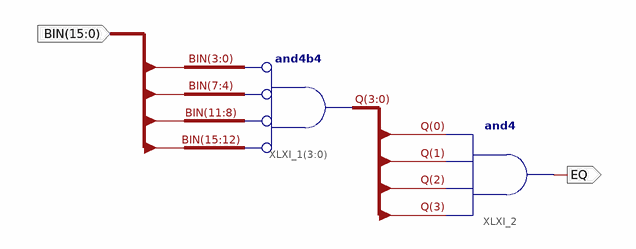
[diagram p0: schematic sheet 1]
// Xilinx ISE schematic Check16BitIs0.sch (spartan6) as structural Verilog: 2 symbols, 2 ports
module Check16BitIs0 (
  input  [15:0] BIN,
  output EQ
);

  wire [3:0] Q;

  assign Q = ~BIN[15:12] & ~BIN[11:8] & ~BIN[7:4] & ~BIN[3:0];  // and4b4 XLXI_1[3..0], 4 bits wide
  and XLXI_2 (EQ, Q[3], Q[2], Q[1], Q[0]);
endmodule
